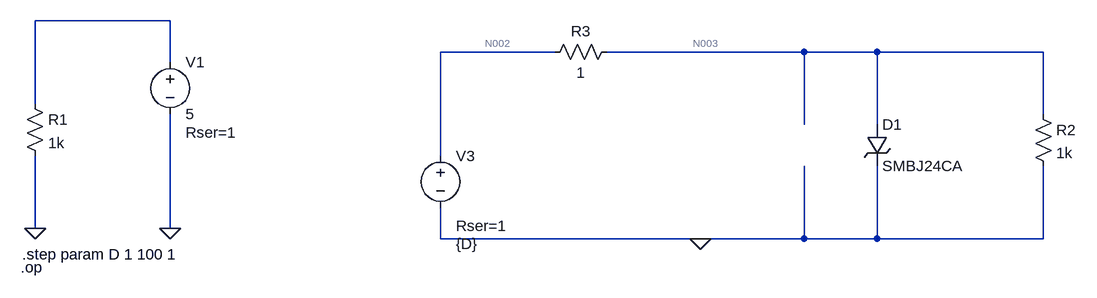
[diagram p0: schematic Draft2.asc]
Draft2.asc, the LTspice schematic file:
Version 4
SHEET 1 880 680
WIRE -656 64 -864 64
WIRE -64 112 -240 112
WIRE 320 112 16 112
WIRE 432 112 320 112
WIRE 688 112 432 112
WIRE -656 128 -656 64
WIRE -864 192 -864 64
WIRE 688 208 688 112
WIRE 320 224 320 112
WIRE 432 224 432 112
WIRE -240 272 -240 112
WIRE -864 384 -864 272
WIRE -656 384 -656 208
WIRE -240 400 -240 352
WIRE 160 400 -240 400
WIRE 320 400 320 288
WIRE 320 400 160 400
WIRE 432 400 432 288
WIRE 432 400 320 400
WIRE 688 400 688 288
WIRE 688 400 432 400
FLAG 160 400 0
FLAG -656 384 0
FLAG -864 384 0
SYMBOL TVSdiode 416 224 R0
SYMATTR InstName D1
SYMATTR Value SMBJ24CA
SYMBOL voltage -656 112 R0
WINDOW 123 0 0 Left 0
WINDOW 39 24 124 Left 2
SYMATTR InstName V1
SYMATTR Value 5
SYMATTR SpiceLine Rser=1
SYMBOL voltage -240 256 R0
WINDOW 3 24 152 Left 2
WINDOW 123 0 0 Left 0
WINDOW 39 24 124 Left 2
SYMATTR InstName V3
SYMATTR Value {D}
SYMATTR SpiceLine Rser=1
SYMBOL res -880 176 R0
SYMATTR InstName R1
SYMATTR Value 1k
SYMBOL res 672 192 R0
SYMATTR InstName R2
SYMATTR Value 1k
SYMBOL res 32 96 R90
WINDOW 0 0 56 VBottom 2
WINDOW 3 32 56 VTop 2
SYMATTR InstName R3
SYMATTR Value 1
TEXT -884 424 Left 2 !.step param D 1 100 1
TEXT -886 444 Left 2 !.op

The netlist it stands for:
* Draft2.asc
D1 N003 0 SMBJ24CA
V1 N001 0 5 Rser=1
V3 N002 0 {D} Rser=1
R1 N001 0 1k
R2 N003 0 1k
R3 N003 N002 1
.model D D
.lib standard.dio
.step param D 1 100 1
.op
.backanno
.end

* Results of the author's LTspice run, read from the files saved beside the schematic
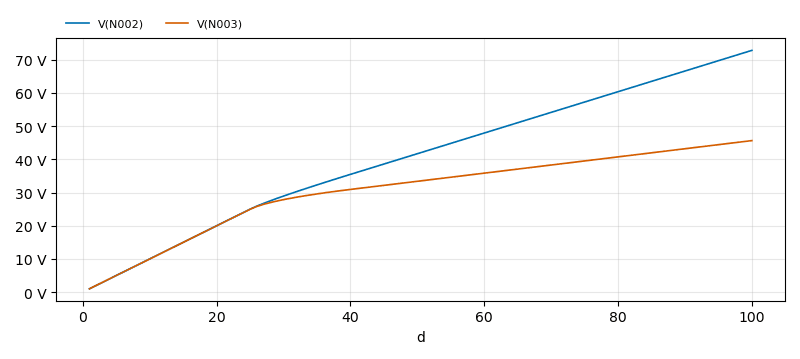
[diagram p1: Operating Point of Draft2.asc, plotted from the saved traces]
* Operating Point, 1 run:
*   V(N002): 999 mV at d=1 , 72.82 V at d=100 , min 999 mV, max 72.82 V
*   V(N003): 998 mV at d=1 , 45.64 V at d=100 , min 998 mV, max 45.64 V
* From the log:
*   Semiconductor Device Operating Points:
*                           --- Diodes ---
*   Name:      d1
*   Model:  smbj24ca
*   Id:      2.00e-08
*   Vd:      9.98e-01
*   Req:     2.00e-08
*   CAP:     0.00e+00